# Altium schematic sheet IoT_Greenhouse V1.0 A - Outputs.SchDoc
size A4; SheetNumber: 5; SheetTotal: 5
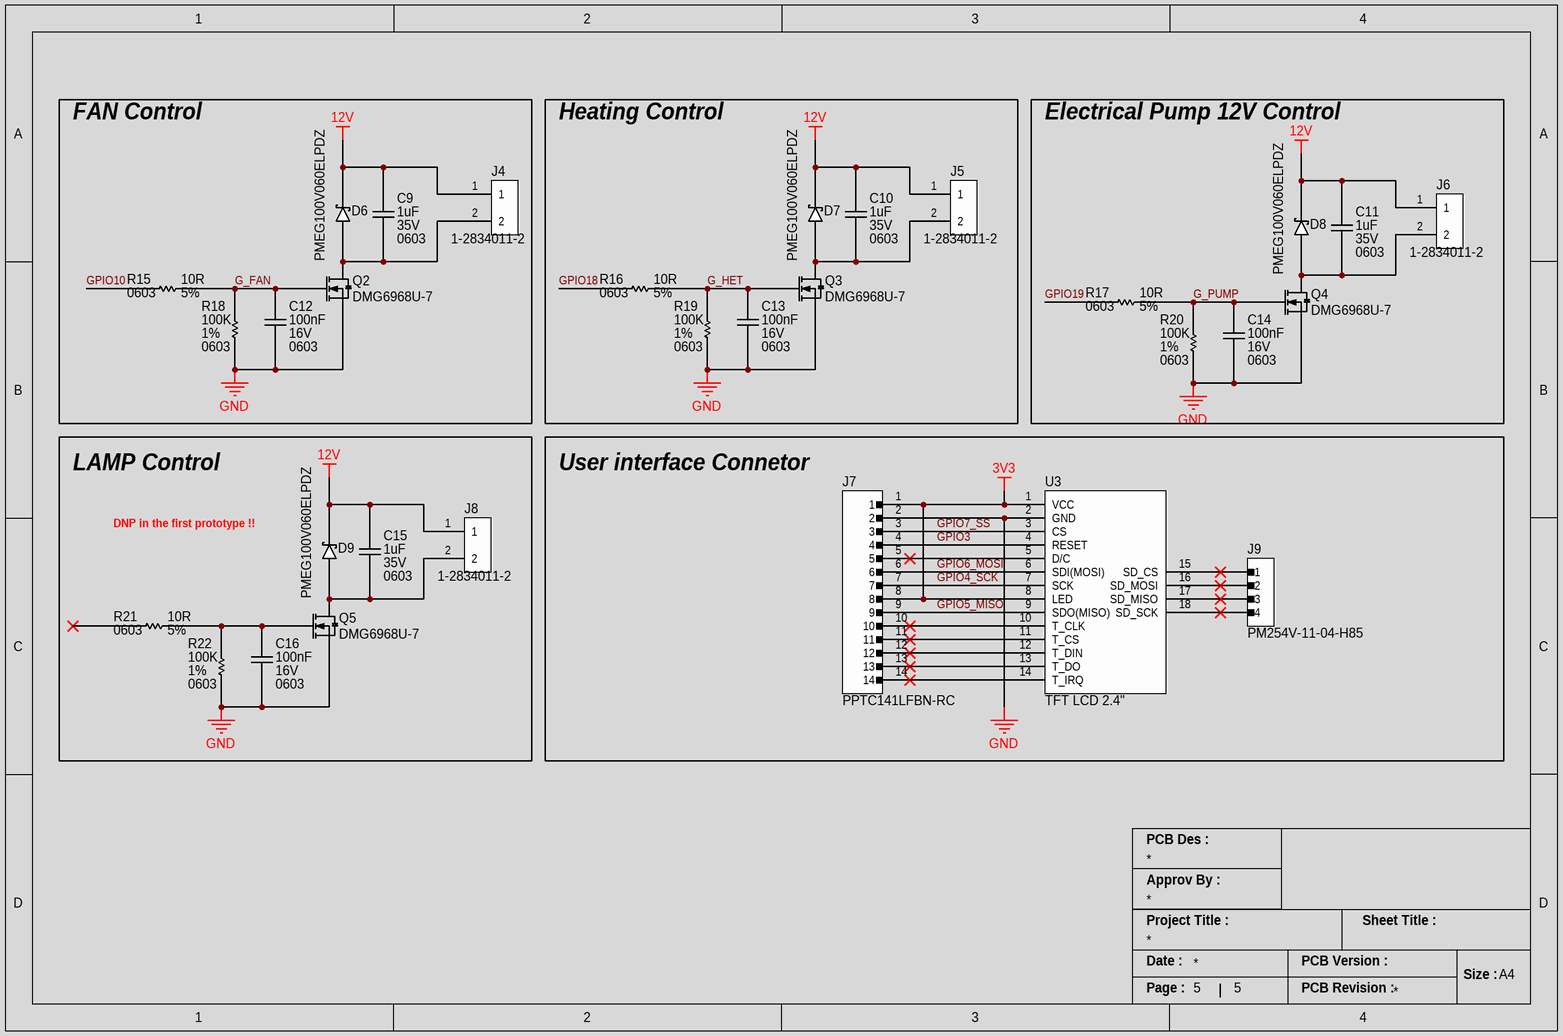
[diagram p0: IoT_Greenhouse V1.0 A - Outputs.SchDoc]

## Parts
C9  Voltage Rating (DC): 35V  Capacitance: 1uF  Case/Package: 0603  [CAP_0603_CAPC1608X08N]  (hidden comment: GMK107BJ105KA-T)
C10  Voltage Rating (DC): 35V  Capacitance: 1uF  Case/Package: 0603  [CAP_0603_CAPC1608X08N]  (hidden comment: GMK107BJ105KA-T)
C11  Voltage Rating (DC): 35V  Capacitance: 1uF  Case/Package: 0603  [CAP_0603_CAPC1608X08N]  (hidden comment: GMK107BJ105KA-T)
C12  Voltage: 16V  Capacitance: 100nF  Case/Package: 0603  [CAP_0603_CAPC1608X08N]  (hidden comment: CL10B104KO8NNNC)
C13  Voltage: 16V  Capacitance: 100nF  Case/Package: 0603  [CAP_0603_CAPC1608X08N]  (hidden comment: CL10B104KO8NNNC)
C14  Voltage: 16V  Capacitance: 100nF  Case/Package: 0603  [CAP_0603_CAPC1608X08N]  (hidden comment: CL10B104KO8NNNC)
C15  Voltage Rating (DC): 35V  Capacitance: 1uF  Case/Package: 0603  [CAP_0603_CAPC1608X08N]  (hidden comment: GMK107BJ105KA-T)
C16  Voltage: 16V  Capacitance: 100nF  Case/Package: 0603  [CAP_0603_CAPC1608X08N]  (hidden comment: CL10B104KO8NNNC)
D6  PMEG100V060ELPDZ  [DIO_SCKTY_PMEG060V100EPDAZ]
D7  PMEG100V060ELPDZ  [DIO_SCKTY_PMEG060V100EPDAZ]
D8  PMEG100V060ELPDZ  [DIO_SCKTY_PMEG060V100EPDAZ]
D9  PMEG100V060ELPDZ  [DIO_SCKTY_PMEG060V100EPDAZ]
J4  1-2834011-2  [CONN_TBLOCK_128340112]
J5  1-2834011-2  [CONN_TBLOCK_128340112]
J6  1-2834011-2  [CONN_TBLOCK_128340112]
J7  PPTC141LFBN-RC  [CONN_HEADER_RHDR14W80P0X254_1X14_3606X254X850P]
J8  1-2834011-2  [CONN_TBLOCK_128340112]
J9  PM254V-11-04-H85  [CONN_HEADER_FEM_4P]
Q2  DMG6968U-7  [SOT_23_3_MMBT2907A-13]
Q3  DMG6968U-7  [SOT_23_3_MMBT2907A-13]
Q4  DMG6968U-7  [SOT_23_3_MMBT2907A-13]
Q5  DMG6968U-7  [SOT_23_3_MMBT2907A-13]
R15  Resistance: 10R  Tolerance: 5%  Case/Package: 0603  [RES_0603_RESC1608X04N]  (hidden comment: RC0603JR-0710RL)
R16  Resistance: 10R  Tolerance: 5%  Case/Package: 0603  [RES_0603_RESC1608X04N]  (hidden comment: RC0603JR-0710RL)
R17  Resistance: 10R  Tolerance: 5%  Case/Package: 0603  [RES_0603_RESC1608X04N]  (hidden comment: RC0603JR-0710RL)
R18  Resistance: 100K  Tolerance: 1%  Case/Package: 0603  [RES_0603_RESC1608X04N]  (hidden comment: RC0603FR-07100KL)
R19  Resistance: 100K  Tolerance: 1%  Case/Package: 0603  [RES_0603_RESC1608X04N]  (hidden comment: RC0603FR-07100KL)
R20  Resistance: 100K  Tolerance: 1%  Case/Package: 0603  [RES_0603_RESC1608X04N]  (hidden comment: RC0603FR-07100KL)
R21  Resistance: 10R  Tolerance: 5%  Case/Package: 0603  [RES_0603_RESC1608X04N]  (hidden comment: RC0603JR-0710RL)
R22  Resistance: 100K  Tolerance: 1%  Case/Package: 0603  [RES_0603_RESC1608X04N]  (hidden comment: RC0603FR-07100KL)
U3  TFT LCD 2.4"  [MODULE_TFT_2.4"]

## Blocks framed on the sheet
User interface Connetor: J7 J9 U3

## Nets
3V3: J7.1 J7.8 U3.1(VCC) U3.8(LED)
12V: C9.2 C10.2 C11.2 C15.2 D6.K D7.K D8.K D9.K J4.1 J5.1 J6.1 J8.1
GND: C12.1 C13.1 C14.1 C16.1 J7.2 Q2.2(S) Q3.2(S) Q4.2(S) Q5.2(S) R18.1 R19.1 R20.1 R22.1 U3.2(GND)
G_FAN: C12.2 Q2.1(G) R15.2 R18.2
G_HET: C13.2 Q3.1(G) R16.2 R19.2
G_PUMP: C14.2 Q4.1(G) R17.2 R20.2
GPIO3: J7.4 U3.4(RESET)
GPIO4_SCK: J7.7 U3.7(SCK)
GPIO5_MISO: J7.9 U3.9(SDO(MISO))
GPIO6_MOSI: J7.6 U3.6(SDI(MOSI))
GPIO7_SS: J7.3 U3.3(CS)
GPIO10: R15.1
GPIO18: R16.1
GPIO19: R17.1
NetC9_1: C9.1 D6.A J4.2 Q2.3(D)
NetC10_1: C10.1 D7.A J5.2 Q3.3(D)
NetC11_1: C11.1 D8.A J6.2 Q4.3(D)
NetC15_1: C15.1 D9.A J8.2 Q5.3(D)
NetC16_2: C16.2 Q5.1(G) R21.2 R22.2
NetJ7_5: J7.5 U3.5(D/C)
NetJ7_10: J7.10 U3.10(T_CLK)
NetJ7_11: J7.11 U3.11(T_CS)
NetJ7_12: J7.12 U3.12(T_DIN)
NetJ7_13: J7.13 U3.13(T_DO)
NetJ7_14: J7.14 U3.14(T_IRQ)
NetJ9_1: J9.1 U3.15(SD_CS)
NetJ9_2: J9.2 U3.16(SD_MOSI)
NetJ9_3: J9.3 U3.17(SD_MISO)
NetJ9_4: J9.4 U3.18(SD_SCK)

Not connected (* = marked no-connect by the designer): R21 1*

## Notes on the sheet
- FAN Control
- Heating Control
- Electrical Pump 12V Control
- LAMP Control
- (near D9) DNP in the first prototype !!
- PCB Des :
- Approv By :
- Project Title :
- Sheet Title :
- Date :
- PCB Version :
- Size :
- A4
- Page :
- PCB Revision :

## Library data of the parts
C9-C11 C15 = CAP_1uF_35V_X5R_0603: Multilayer Ceramic Capacitors (High dielectric type), 35V, 1 uF, ± 10 %, 0603, X5R, RoHS; Manufacturer: Taiyo Yuden; Dielectric Material: 4241ConductorMaterial; Tolerance: 10%; Supplier 1: Digikey; Manufacturer Part Number: GMK107BJ105KA-T; RoHS: Yes; Category: Ceramic Capacitors; Stock 1: 1326938; Pricing 1: 1=0.17, 10=0.108, 50=0.0682, 100=0.0545, 500=0.0394, 1000=0.03484 (USD); Mount: Surface Mount; Case Code (Metric): 1608; Case Code (Imperial): 0603; Material: 4241ConductorMaterial; Min Operating Temperature: -55°C; Max Operating Temperature: 85°C; Packaging: Tape and Reel; Dielectric: X5R; Voltage Rating: 35V; Package Quantity: 4000; Termination: SMD/SMT; Series: M; Construction: Flat; Length: 1.6mm; Width: 0.8mm; Height: 0.8mm; Depth: 0.8mm; Radiation Hardening: No; Halogen Free: 5694HalogenFree; RoHS Compliant: Yes; Lead Free: 5697LeadFree; Reach SVHC Compliant: No; ComponentLink1URL: https://datasheet.ciiva.com/134/gmk107bj105ka-t-ss-134746.pdf?src-supplier=Digikey; ComponentLink1Description: https://datasheet.ciiva.com/134/gmk107bj105ka-t-ss-134746.pdf?src-supplier=Digikey; ComponentLink2URL: https://datasheet.ciiva.com/30065/198gmk107bj105ka-t-30065053.pdf?src-supplier=Onlinecomponents.com; ComponentLink2Description: https://datasheet.ciiva.com/30065/198gmk107bj105ka-t-30065053.pdf?src-supplier=Onlinecomponents.com; ComponentLink3URL: https://datasheet.ciiva.com/11463/gmk107bj105ka-t-ss-11463824.pdf?src-supplier=Avnet; ComponentLink3Description: https://datasheet.ciiva.com/11463/gmk107bj105ka-t-ss-11463824.pdf?src-supplier=Avnet; ComponentLink4URL: https://datasheet.ciiva.com/15920/1014gmk107bj105ka-t-15920678.pdf?src-supplier=Onlinecomponents.com; ComponentLink4Description: https://datasheet.ciiva.com/15920/1014gmk107bj105ka-t-15920678.pdf?src-supplier=Onlinecomponents.com; ComponentLink5URL: https://datasheet.ciiva.com/26871/getdatasheetpartid-637436-26871549.pdf?src-supplier=Verical; ComponentLink5Description: https://datasheet.ciiva.com/26871/getdatasheetpartid-637436-26871549.pdf?src-supplier=Verical; ComponentLink6URL: https://datasheet.ciiva.com/30181/9gmk107bj105ka-t-30181659.pdf?src-supplier=Onlinecomponents.com; ComponentLink6Description: https://datasheet.ciiva.com/30181/9gmk107bj105ka-t-30181659.pdf?src-supplier=Onlinecomponents.com; ComponentLink7URL: https://datasheet.ciiva.com/5415/mlcc-all-e-541559-5415038.pdf?src-supplier=Mouser; ComponentLink7Description: https://datasheet.ciiva.com/5415/mlcc-all-e-541559-5415038.pdf?src-supplier=Mouser; Supplier Part Number 1: 587-1437-6-ND
C12-C14 C16 = CAP_100NF_16V_X7R_0603: Ceramic capacitor SMD-0603 100nF /16V X7R# K +-10%, Samsung, RoHS; Dielectric: X7R; Tolerance: 10%; Manufacturer: Samsung; Manufacturer Part Number: CL10B104KO8NNNC; RoHS: Yes; Category: Ceramic Capacitors; Stock 1: 9799745; Pricing 1: 1=0.10000, 10=0.02700, 50=0.01500, 100=0.01220, 500=0.00874, 1000=0.00686 (USD); Mount: Surface Mount; Case Code (Metric): 1608; Case Code (Imperial): 0603; Material: Ceramic; Contact Plating: Tin; Min Operating Temperature: -55°C; Max Operating Temperature: 125°C; Packaging: Tape and Reel; Package Quantity: 1; Voltage Rating: 16V; Series: CL; Length: 1.6mm; Width: 0.031inch; Height: 0.8mm; Depth: 0.8mm; Thickness: 0.035inch; Radiation Hardening: No; Lead Free: Lead Free; RoHS Compliant: Yes; ComponentLink1URL: https://datasheet.ciiva.com/25805/cl10b104ko8nnnc-25805483.pdf?src-supplier=Digi-Key; ComponentLink1Description: https://datasheet.ciiva.com/25805/cl10b104ko8nnnc-25805483.pdf?src-supplier=Digi-Key; ComponentLink2URL: https://datasheet.ciiva.com/26838/getdatasheetpartid-357417-26838418.pdf?src-supplier=Verical; ComponentLink2Description: https://datasheet.ciiva.com/26838/getdatasheetpartid-357417-26838418.pdf?src-supplier=Verical; ComponentLink3URL: https://datasheet.ciiva.com/29198/456679-da-01-en-vs-kondensator-0603-29198846.pdf?src-supplier=Conrad; ComponentLink3Description: https://datasheet.ciiva.com/29198/456679-da-01-en-vs-kondensator-0603-29198846.pdf?src-supplier=Conrad; Supplier 1: Digi-Key; Supplier 2: Newark; Supplier 3: Mouser; Supplier Part Number 1: 1276-1005-1-ND; Supplier Part Number 2: 82AC9325; Supplier Part Number 3: 187-CL10B104KO8NNNC
D6-D9 = DIO_SCTKY_100V_6A_PMEG100V060ELPDZ: DIODESCHOTTKY100V6ACFP15; Manufacturer: Nexperia; Supplier 1: Digikey; Manufacturer Part Number: PMEG100V060ELPDZ; RoHS: Yes; Category: Schottky Diodes; Stock 1: 60422; Pricing 1: 1=0.58, 10=0.504, 100=0.3491, 500=0.29166 (USD); RoHS Compliant: Yes; ComponentLink1URL: http://www.farnell.com/datasheets/2341403.pdf?src-supplier=Farnell; ComponentLink1Description: http://www.farnell.com/datasheets/2341403.pdf?src-supplier=Farnell; ComponentLink2URL: https://datasheet.octopart.com/PMEG100V060ELPDZ-Nexperia-datasheet-87796136.pdf?src-supplier=Future+Electronics; ComponentLink2Description: https://datasheet.octopart.com/PMEG100V060ELPDZ-Nexperia-datasheet-87796136.pdf?src-supplier=Future+Electronics
J4-J6 J8 = CONN_TBLOCK_2P_3.5mm_1-2834011-2: 2POS3.5MMTOPENTRYSCREWLESSC; Manufacturer: TE Connectivity; Current Rating: 6A; Voltage Rating: 300V; Connector Type: Receptacle,Connector; Number of Positions: 2; Sealable: No (Without); Number of Levels: 1; Wire/Cable Gauge: 14AWG; Wire Gauge (Max): 20AWG; Approvals: UL; Supplier 1: Digikey; Manufacturer Part Number: 1-2834011-2; RoHS: Yes; Category: Terminal Blocks; Stock 1: 110419; Pricing 1: 1=0.25, 10=0.209, 25=0.194, 50=0.1832, 100=0.1732, 250=0.16068, 500=0.15182, 1000=0.14552 (USD); Mount: Through Hole; Number of Pins: 2; Contact Plating: Tin,Lead; Color: Green; Housing Material: Nylon; Min Operating Temperature: -40°C; Max Operating Temperature: 105°C; Packaging: Box; Termination: Through Hole; Contact Current Rating: 6A; Series: -; Number of Positions Per Level: 2; Current: 6A; Voltage: 300V; Wire Gauge (Min): 14AWG; Lead Free: Lead Free; RoHS Compliant: Yes; Reach SVHC Compliant: Unknown; ComponentLink1URL: http://www.te.com/commerce/DocumentDelivery/DDEController?Action=srchrtrv&DocNm=1-1773872-7_ModularScrewlessTerminalBloc&DocType=DS&DocLang=English&src-supplier=Digikey; ComponentLink1Description: http://www.te.com/commerce/DocumentDelivery/DDEController?Action=srchrtrv&DocNm=1-1773872-7_ModularScrewlessTerminalBloc&DocType=DS&DocLang=English&src-supplier=Digikey; ComponentLink2URL: https://datasheet.octopart.com/1-2834011-2-TE-Connectivity-datasheet-62069794.pdf?src-supplier=Farnell; ComponentLink2Description: https://datasheet.octopart.com/1-2834011-2-TE-Connectivity-datasheet-62069794.pdf?src-supplier=Farnell; ComponentLink3URL: http://www.farnell.com/datasheets/2296738.pdf?src-supplier=Newark; ComponentLink3Description: http://www.farnell.com/datasheets/2296738.pdf?src-supplier=Newark; ComponentLink4URL: https://datasheet.octopart.com/1-2834011-2-TE-Connectivity-datasheet-77874288.pdf?src-supplier=Element14; ComponentLink4Description: https://datasheet.octopart.com/1-2834011-2-TE-Connectivity-datasheet-77874288.pdf?src-supplier=Element14; Supplier Part Number 1: A123848-ND
J7 = CONN_HEADER_FEMALE_14P_2.54mm: PPTC Series 14 Position 2.54 mm Single Row Through Hole Pin Header; Manufacturer: Sullins; Number of Positions: 14; Voltage Rating: 250V; Supplier 1: Digikey; Manufacturer Part Number: PPTC141LFBN-RC; RoHS: Yes; Category: Connectors; Stock 1: 3902; Pricing 1: 1=0.92, 10=0.78, 80=0.70075, 440=0.5733, 1000=0.5096, 5000=0.455 (USD); Mount: Through Hole; Contact Material: Bronze; Housing Material: Plastic; Contact Finish - Mating: TIN; Insulation Color: Black; Insulation Material: Polyester; Contact Shape: Square; Min Operating Temperature: -40°C; Max Operating Temperature: 105°C; Number of Rows: 1; Packaging: Tray; Termination: Solder; Connector Type: Header; Contact Type: Female Socket; Fastening Type: Pull; Series: -; Length: 36.1mm; Width: 2.5mm; Height: 8.5mm; Lead Free: Lead Free; RoHS Compliant: Yes; Flammability Rating: UL94 V-0; ComponentLink1URL: https://media.digikey.com/pdf/Data%20Sheets/Sullins%20PDFs/Female_Headers.100_DS.pdf?src-supplier=Digikey; ComponentLink1Description: https://media.digikey.com/pdf/Data%20Sheets/Sullins%20PDFs/Female_Headers.100_DS.pdf?src-supplier=Digikey; Supplier Part Number 1: S7012-ND
J9 = CONN_HEADER_FEMALE_4P_2.54mm_JLCPCB: 2.54mm Plugin 4P Brass Straight 1x4P Plugin,P=2.54mm  Female Headers ROHS; Manufacturer: XFCN; Number of Positions: 4; Connector Type: Header; Voltage Rating: 250V; Supplier: Jlcpcb; Manufacturer Part Number: PM254V-11-04-H85; RoHS: Yes; Category: Connectors; Mount: Through Hole; Contact Material: Bronze; Housing Material: Plastic; Contact Finish - Mating: TIN; Insulation Color: Black; Insulation Material: Polyester; Contact Shape: Square; Min Operating Temperature: -40°C; Max Operating Temperature: 105°C; Number of Rows: 1; Packaging: Tray; Termination: Solder; Contact Type: Female Socket; Fastening Type: Pull; Series: -; Length: 10.7mm; Width: 2.5mm; Height: 8.5mm; Pitch: 2.54mm; Lead Free: Lead Free; RoHS Compliant: Yes; Flammability Rating: UL94 V-0; JLCPCB Part Number: C541851
Q2-Q5 = TRANS_FET_CH_N_20V_6.5A_DMG6968U-7: Trans Mosfet N-ch 20V 6.5A 3-PIN SOT-23 T/r Trans Mosfet N-ch 20V 6.5A 3-PIN SOT-23 T/r; Manufacturer: Diodes; Rise Time: 66ns; Turn-Off Delay Time: 613ns; Turn-On Delay Time: 54ns; Fall Time: 205ns; Gate to Source Voltage (Vgs): 12V; Polarity: N-CHANNEL; Nominal Vgs: 500mV; Input Capacitance: 151pF; Max Power Dissipation: 1.3W; Rds On Max: 25mR; Number of Channels: 1; Drain-source On Resistance-Max: 36mR; Supplier 1: Digikey; Manufacturer Part Number: DMG6968U-7; RoHS: Yes; Category: MOSFETs; Stock 1: 575891; Pricing 1: 1=0.37, 10=0.289, 100=0.1732, 500=0.16034, 1000=0.10903 (USD); Mount: Surface Mount; Case/Package: SOT-23-3; Number of Pins: 3; Weight: 0.000282oz; Min Operating Temperature: -55°C; Max Operating Temperature: 150°C; Packaging: Tape and Reel; Package Quantity: 1; Continuous Drain Current (ID): 6.5A; Series: -; Drain to Source Voltage (Vdss): 20V; Drain to Source Resistance: 25mR; Threshold Voltage: 500mV; Length: 2.9mm; Width: 1.3mm; Height: 1mm; Radiation Hardening: No; Reach SVHC Compliant: No; Lead Free: Lead Free; RoHS Compliant: Yes; ComponentLink1URL: https://datasheet.ciiva.com/5774/ds31738-5774992.pdf?src-supplier=Farnell; ComponentLink1Description: https://datasheet.ciiva.com/5774/ds31738-5774992.pdf?src-supplier=Farnell; ComponentLink2URL: https://datasheet.ciiva.com/22712/1915638-22712395.pdf?src-supplier=Element14; ComponentLink2Description: https://datasheet.ciiva.com/22712/1915638-22712395.pdf?src-supplier=Element14; Supplier Part Number 1: DMG6968UDICT-ND
R15-R17 R21 = RES_10R_5%_100mW_0603: SMD Chip Resistor, 10 Ohm, ± 5%, 100 mW, 0603 [1608 Metric], Thick Film, General Purpose; Manufacturer: Yageo; Temperature Coefficient: 200ppm/°C; Voltage Rating (DC): 50V; Power Rating: 100mW; Supplier 1: Digi-Key; Manufacturer Part Number: RC0603JR-0710RL; RoHS: Yes; Category: Chip SMD Resistors; Stock 1: 769777; Pricing 1: 1=0.1, 10=0.024, 50=0.0154, 100=0.013, 500=0.00894, 1000=0.00773 (USD); Number of Pins: 2; Case Code (Imperial): 0603; Case Code (Metric): 1608; Size Code: 0603; Min Operating Temperature: -55°C; Max Operating Temperature: 155°C; Resistor Type: Thick Film; Packaging: Tape and Reel; Voltage Rating: 50V; Termination: SMD/SMT; Features: Moisture Resistant; Series: RC; Max Power Dissipation: 100mW; Number of Terminations: 2; Construction: Rectangular; Resistance Tolerance: 5%; Length: 1.6mm; Width: 0.8mm; Depth: 0.8mm; Reach SVHC Compliant: No; Lead Free: Lead Free; Military Standard: Not; RoHS Compliant: Yes; ComponentLink1URL: https://datasheet.ciiva.com/46395/443971-46395069.pdf?src-supplier=Element14; ComponentLink1Description: https://datasheet.ciiva.com/46395/443971-46395069.pdf?src-supplier=Element14; ComponentLink2URL: https://datasheet.ciiva.com/7746/443971-7746431.pdf?src-supplier=Element14; ComponentLink2Description: https://datasheet.ciiva.com/7746/443971-7746431.pdf?src-supplier=Element14; Supplier Part Number 1: 311-10GRCT-ND
R18-R20 R22 = RES_100K_1%_100mW_0603: RES SMD 100K OHM 1% 1/10W 0603; Manufacturer: Yageo; Temperature Coefficient: 100ppm/°C; Power Rating: 100mW; Voltage Rating: 50V; Working Voltage: 75V; Supplier 1: Digi-Key; Manufacturer Part Number: RC0603FR-07100KL; RoHS: Yes; Category: Chip SMD Resistors; Stock 1: 11038732; Pricing 1: 1=0.10000, 10=0.01900, 100=0.00770, 1000=0.00345, 2500=0.00300 (USD); Number of Pins: 2; Case Code (Imperial): 0603; Case Code (Metric): 1608; Min Operating Temperature: -55°C; Max Operating Temperature: 155°C; Resistor Type: Thick Film; Voltage Rating (DC): 50V; Packaging: Tape and Reel; Termination: SMD/SMT; Number of Terminations: 2; Features: Moisture Resistant; Series: RC; Max Power Dissipation: 100mW; Resistance Tolerance: 1%; Construction: Rectangular; Technology: THICK FILM; Length: 1.6mm; Width: 0.8mm; Height: 0.45mm; Depth: 0.8mm; Reach SVHC Compliant: Yes; Military Standard: Not; Lead Free: Lead Free; RoHS Compliant: Yes; ComponentLink1URL: https://datasheet.ciiva.com/11808/0900766b80f96399-11808107.pdf?src-supplier=Rs; ComponentLink1Description: https://datasheet.ciiva.com/11808/0900766b80f96399-11808107.pdf?src-supplier=Rs; ComponentLink2URL: https://datasheet.ciiva.com/7983/443971-7983593.pdf?src-supplier=Element14; ComponentLink2Description: https://datasheet.ciiva.com/7983/443971-7983593.pdf?src-supplier=Element14; ComponentLink3URL: https://datasheet.ciiva.com/22747/443971-22747516.pdf?src-supplier=Element14; ComponentLink3Description: https://datasheet.ciiva.com/22747/443971-22747516.pdf?src-supplier=Element14; ComponentLink4URL: https://datasheet.ciiva.com/46440/1868787-46440889.pdf?src-supplier=Element14; ComponentLink4Description: https://datasheet.ciiva.com/46440/1868787-46440889.pdf?src-supplier=Element14; ComponentLink5URL: https://datasheet.ciiva.com/7746/1738695-7746235.pdf?src-supplier=Element14; ComponentLink5Description: https://datasheet.ciiva.com/7746/1738695-7746235.pdf?src-supplier=Element14; ComponentLink6URL: https://datasheet.ciiva.com/7746/1738695-7746234.pdf?src-supplier=Element14; ComponentLink6Description: https://datasheet.ciiva.com/7746/1738695-7746234.pdf?src-supplier=Element14; Supplier Part Number 1: 311-100KHRDKR-ND
U3 = MODULE_TFT_2.4": Display Lcd 2.4 Pol 240x320 Micro Sd Touch Screen